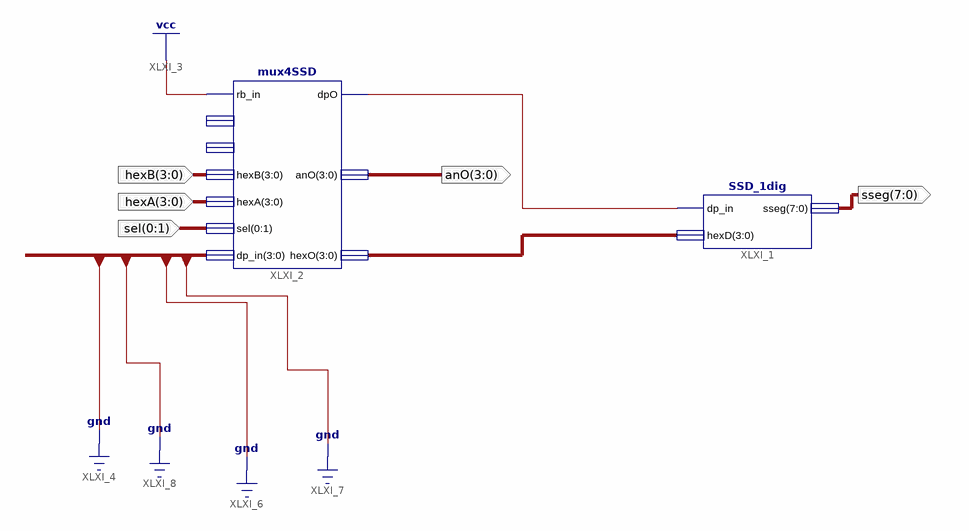
[diagram p0: schematic sheet 1]
// Xilinx ISE schematic lab6_experiment2_2.sch (spartan3e) as structural Verilog: 2 symbols, 5 ports
module lab6_experiment2_2 (
  input  [0:1] sel,
  input  [3:0] hexA,
  input  [3:0] hexB,
  output [3:0] anO,
  output [7:0] sseg
);

  wire XLXN_14;
  wire [3:0] XLXN_13;

  SSD_1dig XLXI_1 (.dp_in(XLXN_14), .hexD(XLXN_13), .sseg(sseg));
  mux4SSD XLXI_2 (
    .rb_in(1'b1), .hexB(hexB), .hexA(hexA), .sel(sel), .dp_in(4'b0000), .dpO(XLXN_14), .anO(anO),
    .hexO(XLXN_13));  // open: hexD, hexC
endmodule
